# Altium project ЭАЕСН.464512.002Э4.PrjPcb
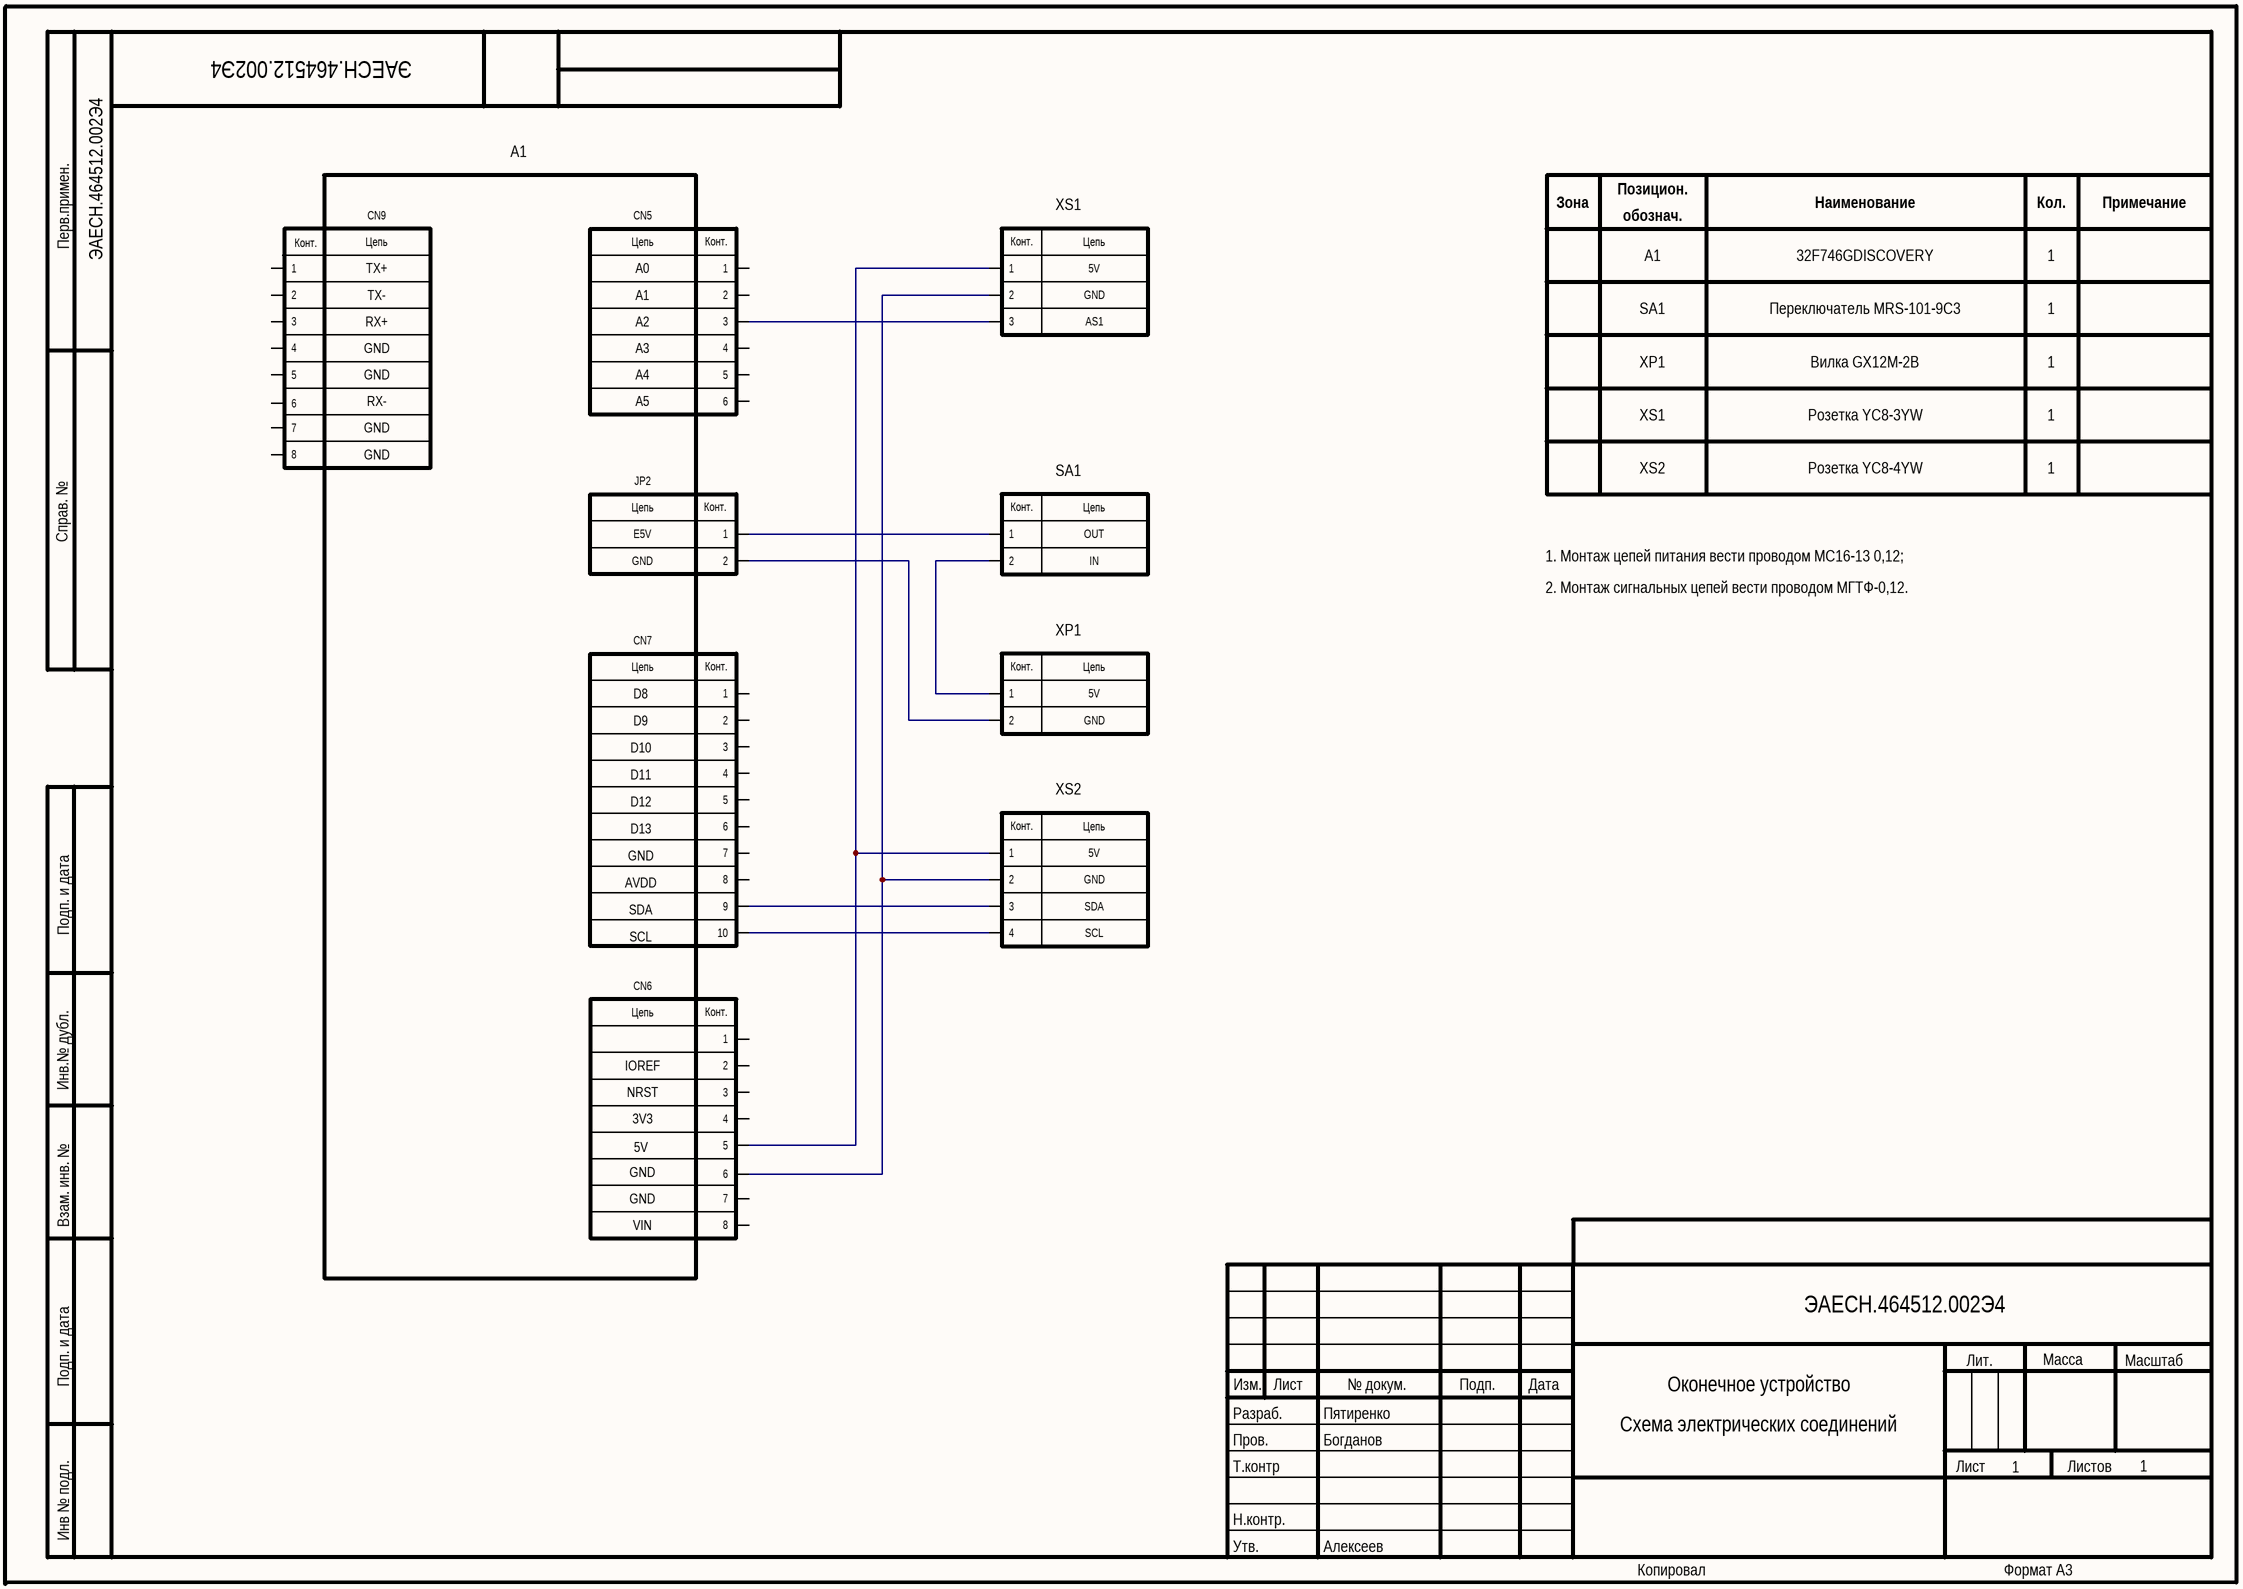
[diagram p0: Sheet2.SchDoc]
5 sheets, 47 parts. Net scope: global (net labels, ports and power ports of the same name join across sheets).
Sheets:
  Sheet2.SchDoc
  Э4_1.SchDoc
  Э4_2.SchDoc
  Э4_1_New.SchDoc
  Э4_2_New.SchDoc

## Sheet Sheet2.SchDoc: Оконечное устройство
size 420 x 297 mm; ApprovedBy: Алексеев; CheckedBy: Богданов; Author: Пятиренко; DocumentNumber: ЭАЕСН.464512.002Э4; SheetNumber: 1; SheetTotal: 1; PERVICH PRIM: ЭАЕСН.464512.002Э4; Title2: Схема электрических соединений; PageSetup: Record=PageOptions|CenterHorizontal=True|CenterVertical=True|PrintScale=0.98|XCorrection=1.00|YCorrection=1.00|PrintKind=1|BorderSize=5000000|LeftOffset=0|BottomOffset=0|Orientation=2|PaperLength=1000|PaperWidth=1000|Scale=100|PaperSource=7|PrintQuality=600|MediaType=1|DitherType=10|PrintScaleMode=1|PaperKind=A3|PaperIndex=8

### Parts
A1  32F746GDISCOVERY  (value not drawn)
SA1  MRS-101-9C3  (value not drawn)
XP1  GX12M-2B  (value not drawn)
XS1  YC8-3YW  (value not drawn)
XS2  YC8-4YW  (value not drawn)

### Nets
NetA1_1: A1.1 SA1.1
NetA1_2: A1.2 XP1.2
NetA1_3: A1.3 XS1.3
NetA1_5: A1.5 XS1.1 XS2.1
NetA1_6: A1.6 XS1.2 XS2.2
NetA1_9: A1.9 XS2.3
NetA1_10: A1.10 XS2.4
NetSA1_2: SA1.2 XP1.1

Not connected (* = marked no-connect by the designer): A1 4 7 8

### Notes on the sheet
- Позицион.
- (near A1) CN9
- (near A1) CN5
- Зона
- обознач.
- A1
- Наименование
- 32F746GDISCOVERY
- Кол.
- 1
- Примечание
- AS1
- 5V
- GND
- SA1
- Переключатель MRS-101-9C3
- XP1
- Вилка GX12M-2B
- XS1
- XS2
- Розетка YC8-3YW
- Розетка YC8-4YW
- (near A1) JP2
- OUT
- IN
- 1. Монтаж цепей питания вести проводом МС16-13 0,12;
- 2. Монтаж сигнальных цепей вести проводом МГТФ-0,12.
- (near A1) CN7
- SDA
- SCL
- (near A1) CN6
- Перв.примен.
- Справ. №
- Подп. и дата
- Инв.№ дубл.
- Взам. инв. №
- Изм.
- Лист
- № докум.
- Подп.
- Дата
- Лит.
- Масса
- Масштаб
- Пров.
- Т.контр
- Разраб.
- Листов
- Инв № подл.
- Н.контр.
- Утв.
- Копировал
- Формат А3
- (in symbol 32F746GDISCOVERY) Конт.; Цепь; TX+; A0; TX-; RX+; A2; GND; A3; A4; RX-; A5; E5V; D8; D9; D10; D11; D12; D13; AVDD; SDA; SCL; IOREF; NRST; 3V3; 5V; VIN
- (in symbol GX12M-2B) Конт.; Цепь
- (in symbol MRS-101-9C3) Конт.; Цепь
- (in symbol YC8-3YW) Конт.; Цепь
- (in symbol YC8-4YW) Конт.; Цепь

## Sheet Э4_1.SchDoc: Оконечное устройство
size 420 x 297 mm; ApprovedBy: Алексеев; CheckedBy: Богданов; Author: Пятиренко; DocumentNumber: ЭАЕСН.464512.002Э4; SheetNumber: 1; SheetTotal: 2; PERVICH PRIM: ЭАЕСН.464512.002; Title2: Схема электрических соединений; DocumentName: Sheet1.SCHDOC; Application_BuildNumber: sdfsdfsdfsdfsdfs
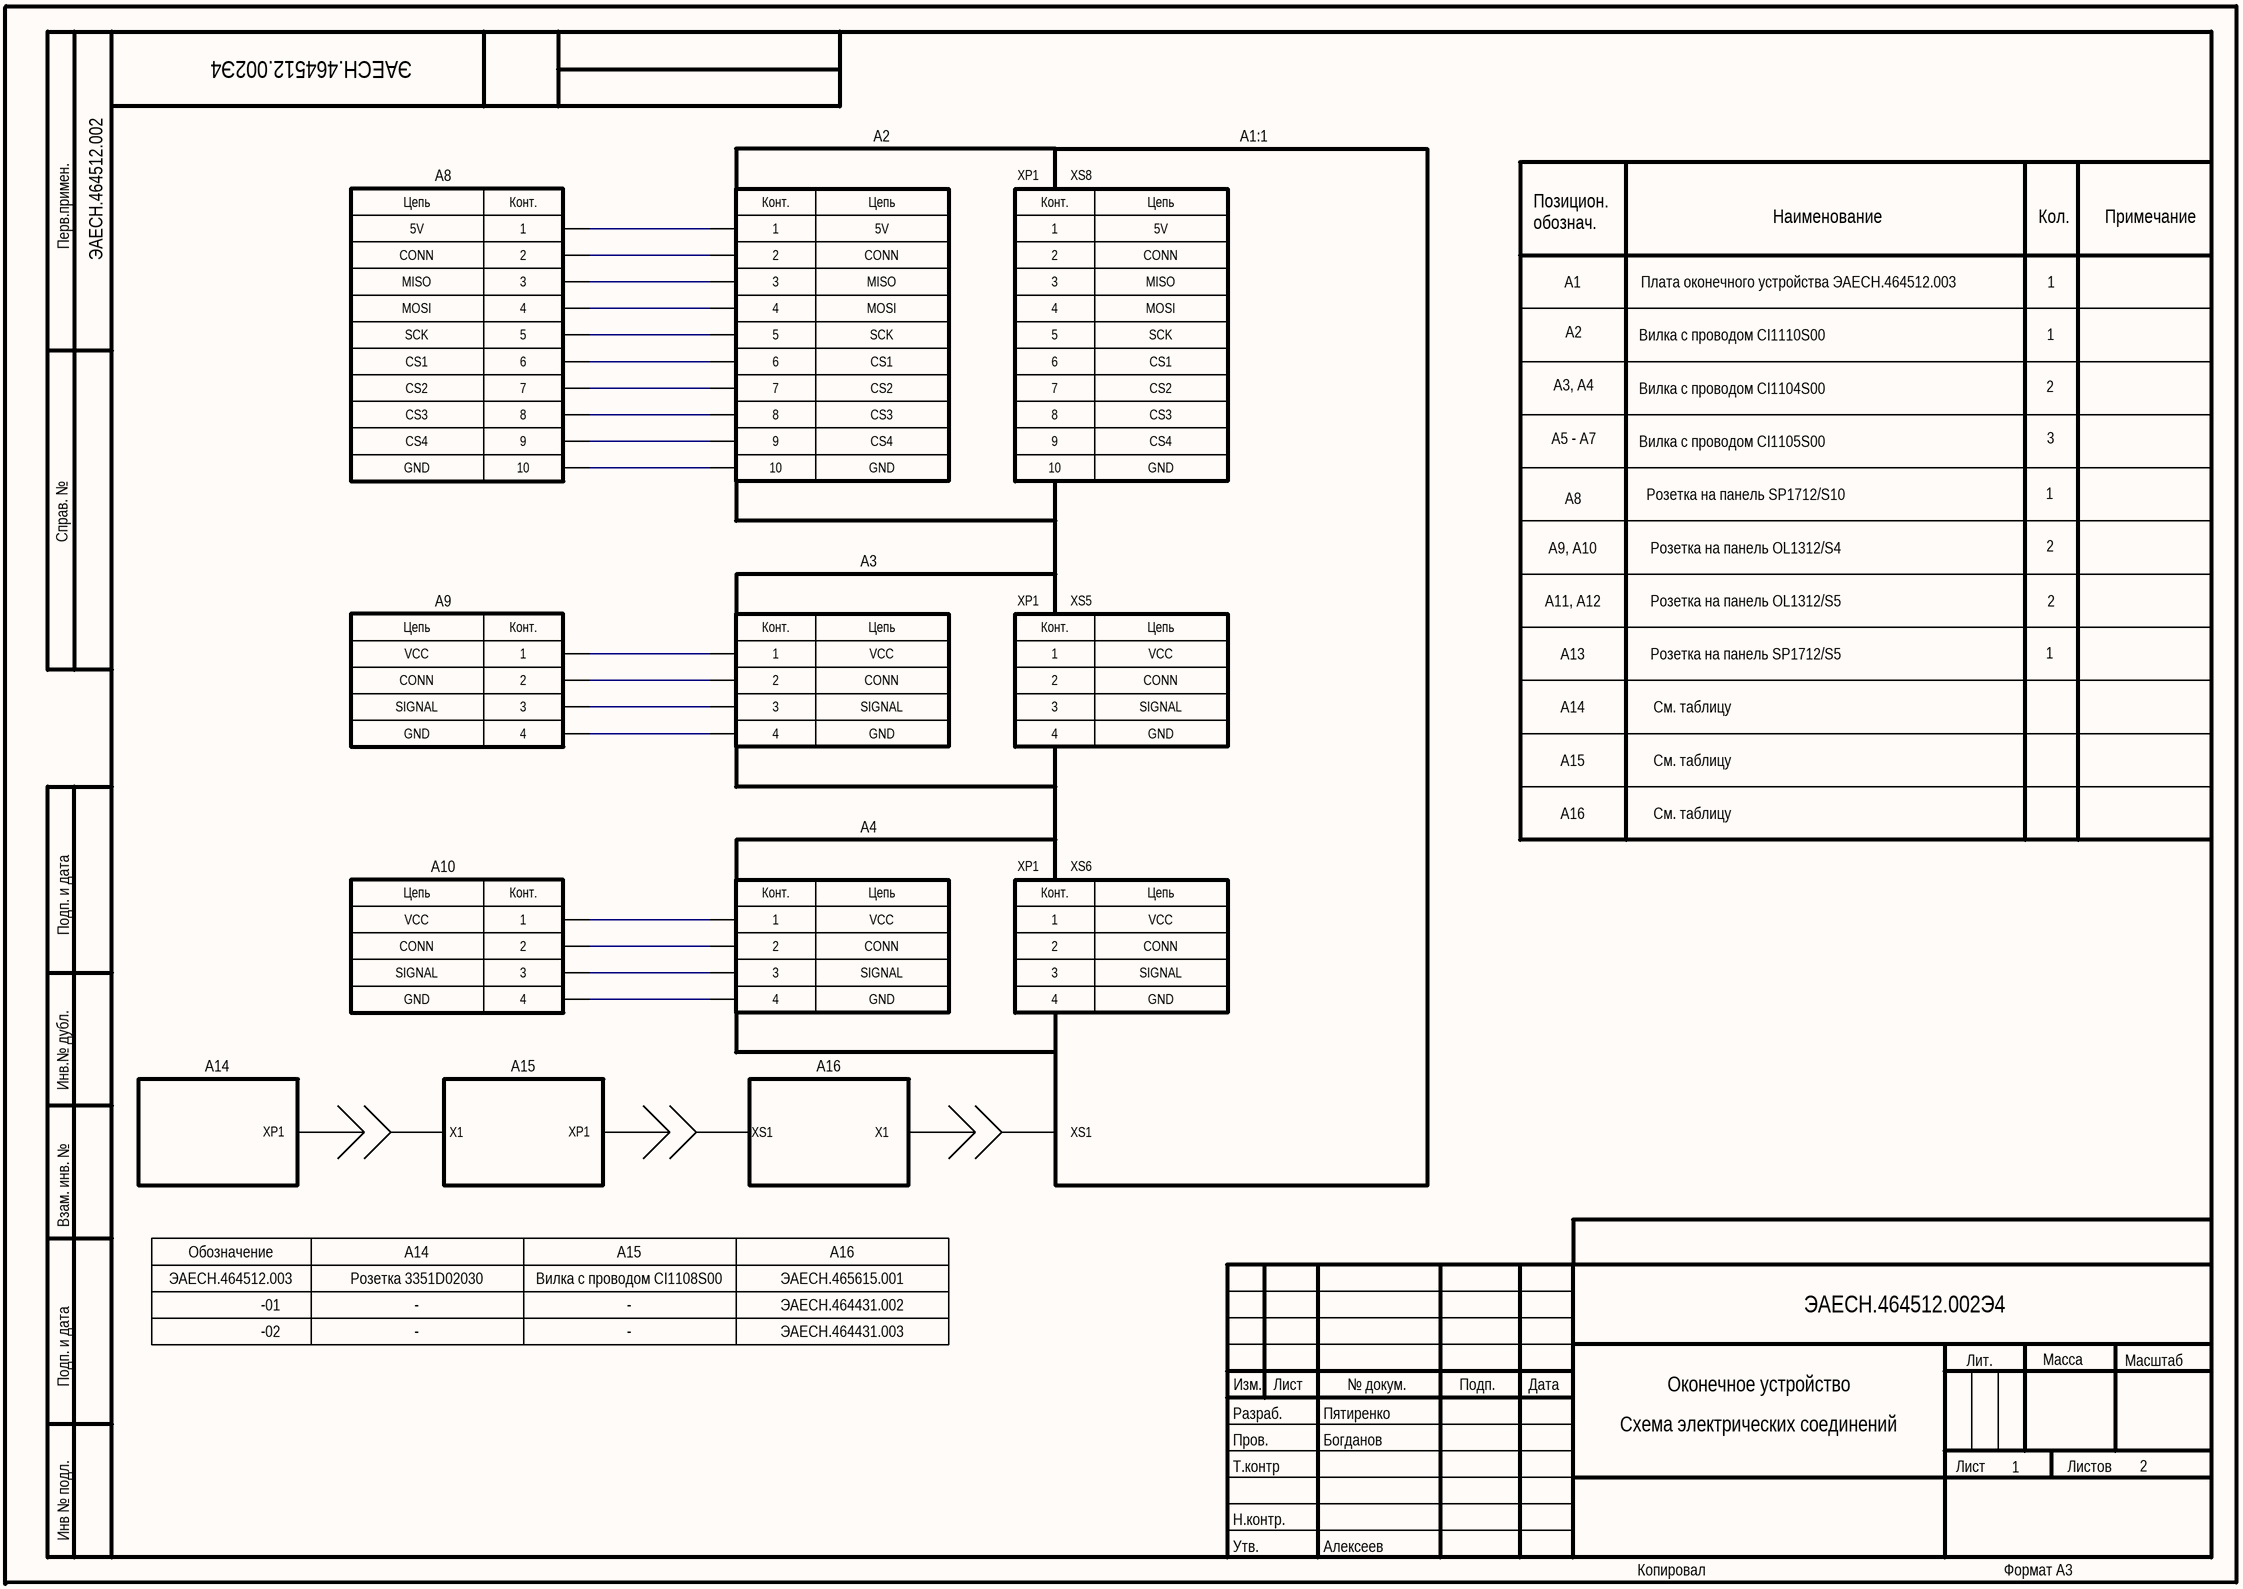
[diagram p1: Э4_1.SchDoc]

### Parts
X4  10pin  (value not drawn)
X5  10pin  (value not drawn)
X6  10pin_con  (value not drawn)
X10  4pin  (value not drawn)
X11  4pin  (value not drawn)
X12  4pin_con  (value not drawn)
X16  4pin  (value not drawn)
X17  4pin  (value not drawn)
X18  4pin_con  (value not drawn)

### Nets
NetX4_1: X4.1 X5.1
NetX4_1: X4.1 X5.1  [a separate net that carries the same name]
NetX4_2: X4.2 X5.2
NetX4_2: X4.2 X5.2  [a separate net that carries the same name]
NetX4_3: X4.3 X5.3
NetX4_3: X4.3 X5.3  [a separate net that carries the same name]
NetX4_4: X4.4 X5.4
NetX4_4: X4.4 X5.4  [a separate net that carries the same name]
NetX4_4: X4.4 X5.4  [a separate net that carries the same name]
NetX4_4: X4.4 X5.4  [a separate net that carries the same name]
NetX10_1: X10.1 X11.1
NetX10_2: X10.2 X11.2
NetX10_3: X10.3 X11.3
NetX10_4: X10.4 X11.4
NetX16_1: X16.1 X17.1
NetX16_2: X16.2 X17.2
NetX16_3: X16.3 X17.3
NetX16_4: X16.4 X17.4

### Notes on the sheet
- A8
- A2
- (near X6) XP1
- XS8
- A1:1
- 5V
- CONN
- Позицион.
  обознач.
- Наименование
- Кол.
- Примечание
- MISO
- MOSI
- SCK
- A1
- Вилка с проводом CI1110S00
- Плата оконечного устройства ЭАЕСН.464512.003
- 1
- CS1
- CS2
- A3, А4
- Вилка с проводом CI1104S00
- 2
- GND
- CS3
- CS4
- A5 - A7
- Вилка с проводом CI1105S00
- 3
- Розетка на панель SP1712/S10
- A9
- A3
- (near X12) XP1
- XS5
- A9, А10
- A11, А12
- Розетка на панель OL1312/S4
- Розетка на панель OL1312/S5
- VCC
- A13
- Розетка на панель SP1712/S5
- SIGNAL
- A14
- См. таблицу
- A15
- A10
- A4
- (near X18) XP1
- XS6
- A16
- XP1
- X1
- XS1
- Обозначение
- ЭАЕСН.464512.003
- Розетка 3351D02030
- Вилка с проводом CI1108S00
- ЭАЕСН.465615.001
- -01
- -02
- -
- ЭАЕСН.464431.002
- ЭАЕСН.464431.003
- Перв.примен.
- Справ. №
- Подп. и дата
- Инв.№ дубл.
- Взам. инв. №
- Изм.
- Лист
- № докум.
- Подп.
- Дата
- Лит.
- Масса
- Масштаб
- Пров.
- Т.контр
- Разраб.
- Листов
- Инв № подл.
- Н.контр.
- Утв.
- Копировал
- Формат А3
- (in symbol 4pin) Конт.; Цепь
- (in symbol 4pin_con) Конт.; Цепь; 1; 2; 3; 4
- (in symbol 10pin) Конт.; Цепь; 5; 6; 7; 8; 9; 10
- (in symbol 10pin_con) Конт.; Цепь; 1; 2; 3; 4; 5; 6; 7; 8; 9; 10

## Sheet Э4_2.SchDoc
size 420 x 297 mm; DocumentNumber: ЭАЕСН.464512.002Э4; SheetNumber: 2; SheetTotal: 2
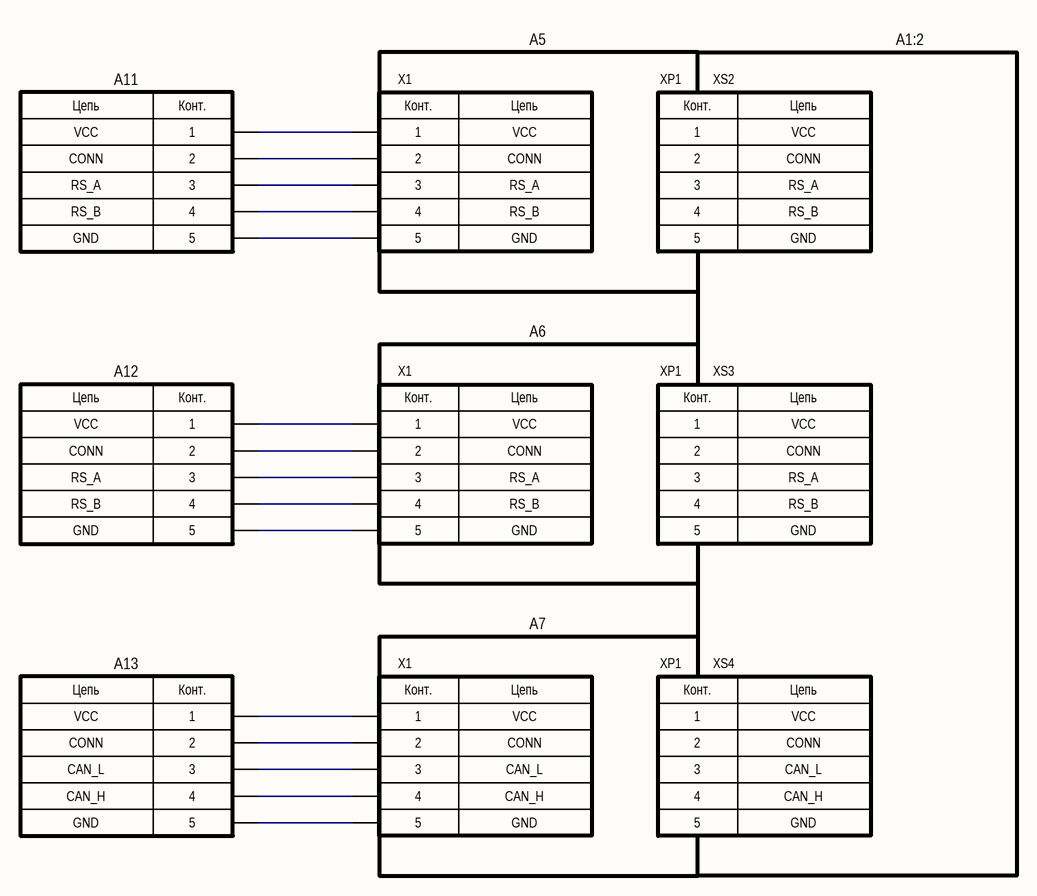
[diagram p2: Э4_2.SchDoc]

### Parts
X1  5pin  (value not drawn)
X2  5pin  (value not drawn)
X3  5pin_con  (value not drawn)
X7  5pin  (value not drawn)
X8  5pin  (value not drawn)
X9  5pin_con  (value not drawn)
X13  5pin  (value not drawn)
X14  5pin  (value not drawn)
X15  5pin_con  (value not drawn)

### Nets
NetX1_1: X1.1 X2.1
NetX1_2: X1.2 X2.2
NetX1_3: X1.3 X2.3
NetX1_4: X1.4 X2.4
NetX1_4: X1.4 X2.4  [a separate net that carries the same name]
NetX7_1: X7.1 X8.1
NetX7_2: X7.2 X8.2
NetX7_3: X7.3 X8.3
NetX7_4: X7.4 X8.4
NetX7_4: X7.4 X8.4  [a separate net that carries the same name]
NetX13_1: X13.1 X14.1
NetX13_2: X13.2 X14.2
NetX13_3: X13.3 X14.3
NetX13_4: X13.4 X14.4
NetX13_4: X13.4 X14.4  [a separate net that carries the same name]

### Notes on the sheet
- A5
- A1:2
- VCC
- A11
- (near X1) X1
- (near X3) XP1
- XS2
- CONN
- RS_A
- RS_B
- GND
- A6
- A12
- (near X7) X1
- (near X9) XP1
- XS3
- A13
- (near X13) X1
- A7
- (near X15) XP1
- XS4
- CAN_L
- CAN_H
- Подп. и дата
- Инв.№ дубл.
- Взам. инв. №
- Инв № подл.
- Изм.
- Лист
- № докум.
- Подп.
- Дата
- Копировал
- Формат А3
- (in symbol 5pin) Конт.; Цепь; 5
- (in symbol 5pin_con) Конт.; Цепь; 1; 2; 3; 4; 5

## Sheet Э4_1_New.SchDoc: Оконечное устройство
size 420 x 297 mm; ApprovedBy: Алексеев; CheckedBy: Богданов; Author: Пятиренко; DocumentNumber: АЕСН.464512.002Э4; SheetNumber: 1; SheetTotal: 2; Title2: Схема электрических соединений; PERVICH PRIM: АЕСН.464512.002; Application_BuildNumber: sdfsdfsdfsdfsdfs
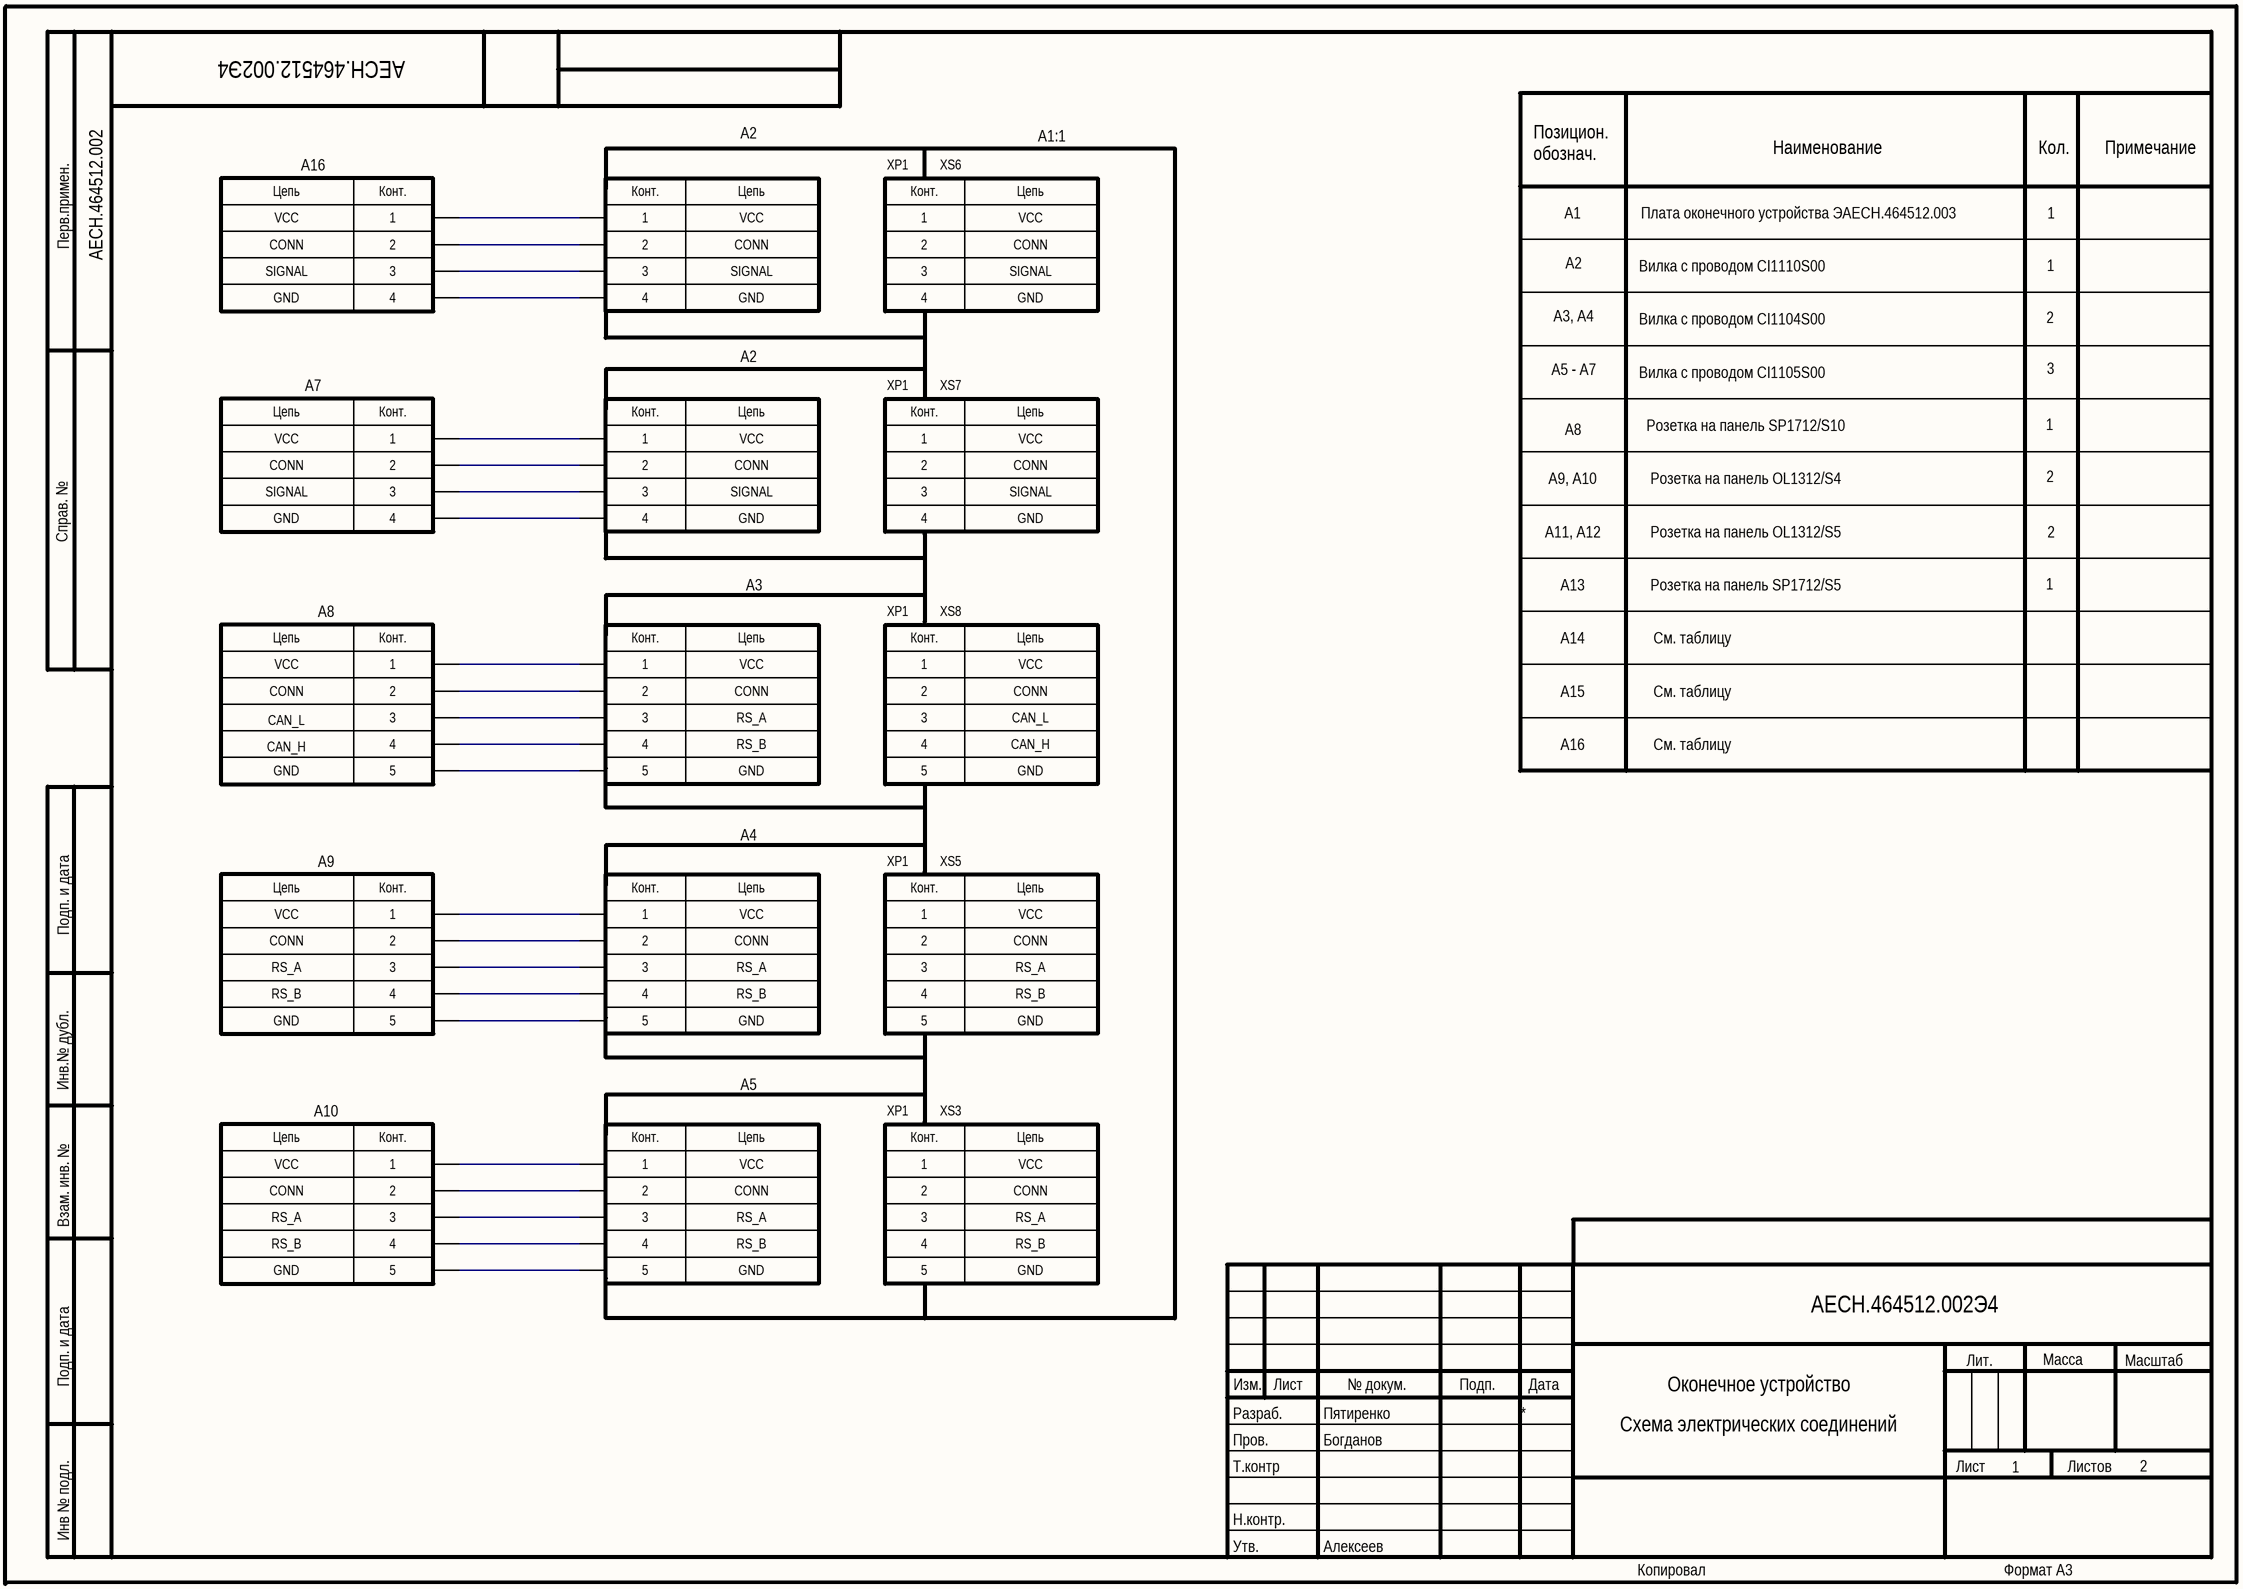
[diagram p3: Э4_1_New.SchDoc]

### Parts
(Parts that share a designator on the sheet are numbered #1, #2 ... from top to bottom, then left to right.)
X?#1  4pin  (value not drawn)
X?#2  4pin  (value not drawn)
X?#3  4pin_con  (value not drawn)
X?#4  4pin  (value not drawn)
X?#5  4pin  (value not drawn)
X?#6  4pin_con  (value not drawn)
X?#7  5pin  (value not drawn)
X?#8  5pin  (value not drawn)
X?#9  5pin_con  (value not drawn)
X?#10  5pin  (value not drawn)
X?#11  5pin  (value not drawn)
X?#12  5pin_con  (value not drawn)
X?#13  5pin  (value not drawn)
X?#14  5pin  (value not drawn)
X?#15  5pin_con  (value not drawn)

### Nets
NetX?#1_1: X?#1.1 X?#2.1
NetX?#1_2: X?#1.2 X?#2.2
NetX?#1_3: X?#1.3 X?#2.3
NetX?#1_4: X?#1.4 X?#2.4
NetX?#4_1: X?#4.1 X?#5.1
NetX?#4_2: X?#4.2 X?#5.2
NetX?#4_3: X?#4.3 X?#5.3
NetX?#4_4: X?#4.4 X?#5.4
NetX?#7_1: X?#7.1 X?#8.1
NetX?#7_2: X?#7.2 X?#8.2
NetX?#7_3: X?#7.3 X?#8.3
NetX?#7_4: X?#7.4 X?#8.4
NetX?#7_4: X?#7.4 X?#8.4  [a separate net that carries the same name]
NetX?#10_1: X?#10.1 X?#11.1
NetX?#10_2: X?#10.2 X?#11.2
NetX?#10_3: X?#10.3 X?#11.3
NetX?#10_4: X?#10.4 X?#11.4
NetX?#10_4: X?#10.4 X?#11.4  [a separate net that carries the same name]
NetX?#13_1: X?#13.1 X?#14.1
NetX?#13_2: X?#13.2 X?#14.2
NetX?#13_3: X?#13.3 X?#14.3
NetX?#13_4: X?#13.4 X?#14.4
NetX?#13_4: X?#13.4 X?#14.4  [a separate net that carries the same name]

### Notes on the sheet
- A16
- A2
- (near X?#3) XP1
- XS6
- A1:1
- Позицион.
  обознач.
- Наименование
- Кол.
- Примечание
- VCC
- CONN
- A1
- Вилка с проводом CI1110S00
- Плата оконечного устройства ЭАЕСН.464512.003
- 1
- SIGNAL
- GND
- A3, А4
- Вилка с проводом CI1104S00
- 2
- A7
- (near X?#6) XP1
- XS7
- A5 - A7
- Вилка с проводом CI1105S00
- 3
- A8
- Розетка на панель SP1712/S10
- A9, А10
- A11, А12
- Розетка на панель OL1312/S4
- Розетка на панель OL1312/S5
- A3
- A13
- Розетка на панель SP1712/S5
- (near X?#9) XP1
- XS8
- A14
- См. таблицу
- CAN_L
- RS_A
- A15
- CAN_H
- RS_B
- A9
- A4
- (near X?#12) XP1
- XS5
- A10
- A5
- (near X?#15) XP1
- XS3
- Перв.примен.
- Справ. №
- Подп. и дата
- Инв.№ дубл.
- Взам. инв. №
- Изм.
- Лист
- № докум.
- Подп.
- Дата
- Лит.
- Масса
- Масштаб
- Пров.
- Т.контр
- Разраб.
- Листов
- Инв № подл.
- Н.контр.
- Утв.
- Копировал
- Формат А3
- (in symbol 4pin) Конт.; Цепь
- (in symbol 4pin_con) Конт.; Цепь; 1; 2; 3; 4
- (in symbol 5pin) Конт.; Цепь; 5
- (in symbol 5pin_con) Конт.; Цепь; 1; 2; 3; 4; 5

## Sheet Э4_2_New.SchDoc
size 420 x 297 mm; DocumentNumber: АЕСН.464512.002Э4; SheetNumber: 2; SheetTotal: 2
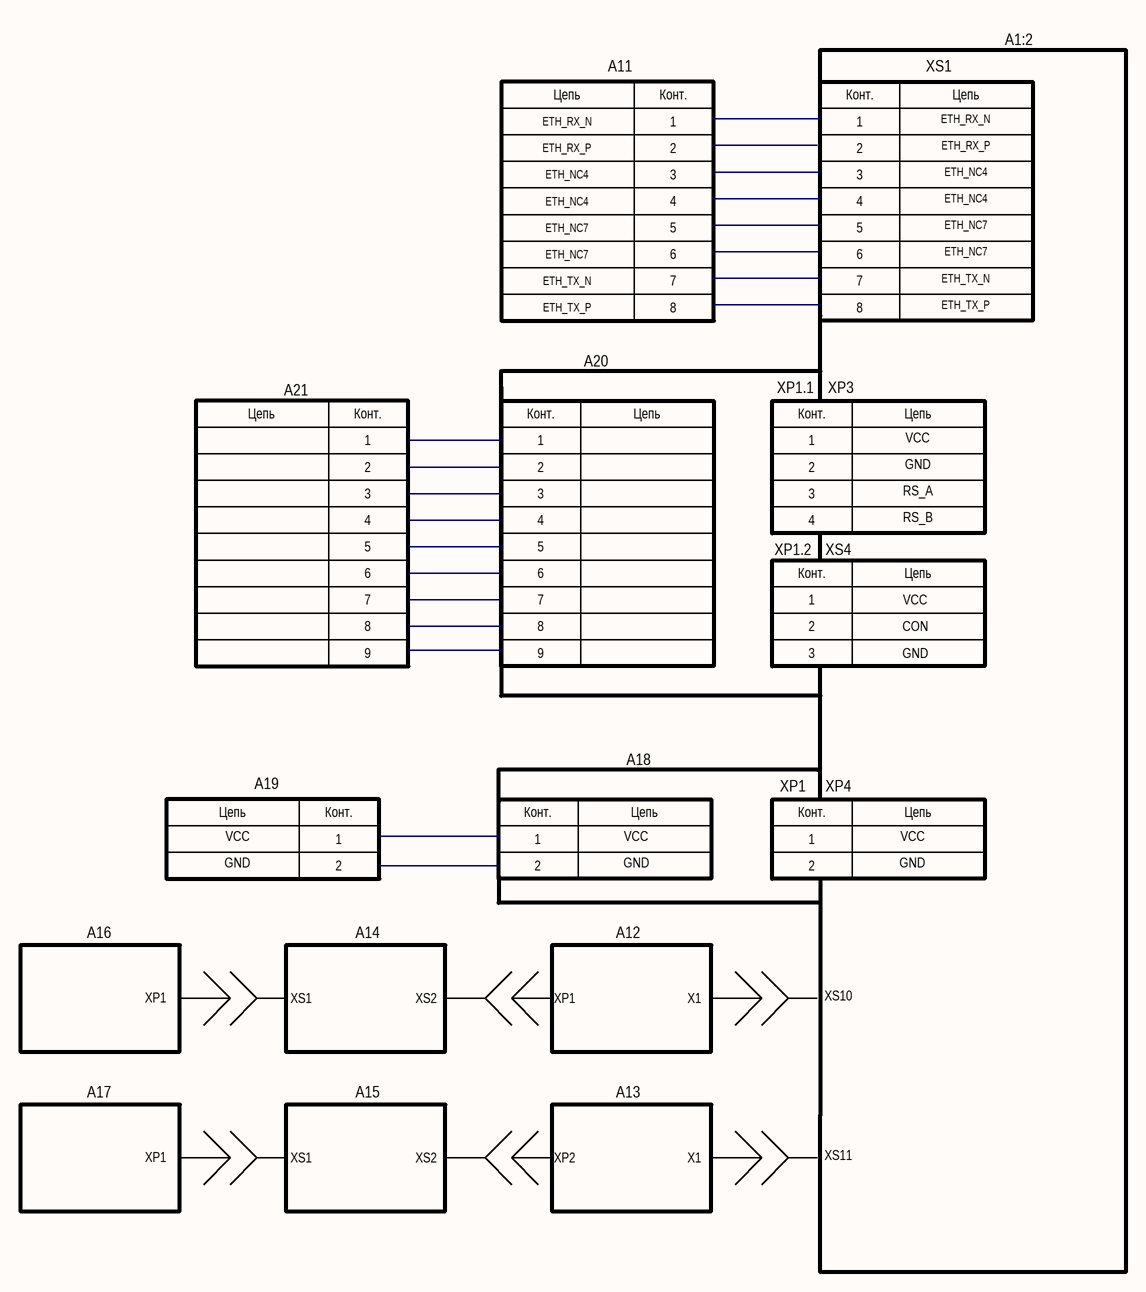
[diagram p4: Э4_2_New.SchDoc]

### Parts
(Parts that share a designator on the sheet are numbered #1, #2 ... from top to bottom, then left to right.)
*#1  9pin  (value not drawn)
*#2  9pin  (value not drawn)
*#3  3pin  (value not drawn)
*#4  2pin  (value not drawn)
*?#1  2pin  (value not drawn)
*?#2  2pin  (value not drawn)
?  8pin  (value not drawn)
A11  8pin  (value not drawn)
X?#16  4pin_con  (value not drawn)

### Notes on the sheet
- A1:2
- ETH_RX_N
- A11
- XS1
- ETH_RX_P
- (near A11) ETH_NC4
- ETH_NC4
- (near A11) ETH_NC7
- ETH_NC7
- ETH_TX_N
- ETH_TX_P
- A21
- A20
- (near X?#16) XP1.1
- XP3
- VCC
- GND
- RS_A
- RS_B
- XP1.2
- XS4
- (near *#3) VCC
- (near *#3) CON
- (near *#3) GND
- A19
- A18
- XP1
- XP4
- (near *#4) VCC
- (near *#4) GND
- (near *?#1) VCC
- (near *?#1) GND
- (near *?#2) VCC
- (near *?#2) GND
- A16
- A14
- A12
- XS2
- X1
- XS10
- A17
- A15
- A13
- XP2
- XS11
- Подп. и дата
- Инв.№ дубл.
- Взам. инв. №
- Инв № подл.
- Изм.
- Лист
- № докум.
- Подп.
- Дата
- Копировал
- Формат А3
- (in symbol 2pin) Цепь; Конт.; 1; 2
- (in symbol 3pin) Конт.; Цепь; 1; 2; 3
- (in symbol 4pin_con) Конт.; Цепь; 1; 2; 3; 4
- (in symbol 8pin) Цепь; Конт.; 1; 2; 3; 4; 5; 6; 7; 8
- (in symbol 9pin) Цепь; Конт.; 1; 2; 3; 4; 5; 6; 7; 8; 9